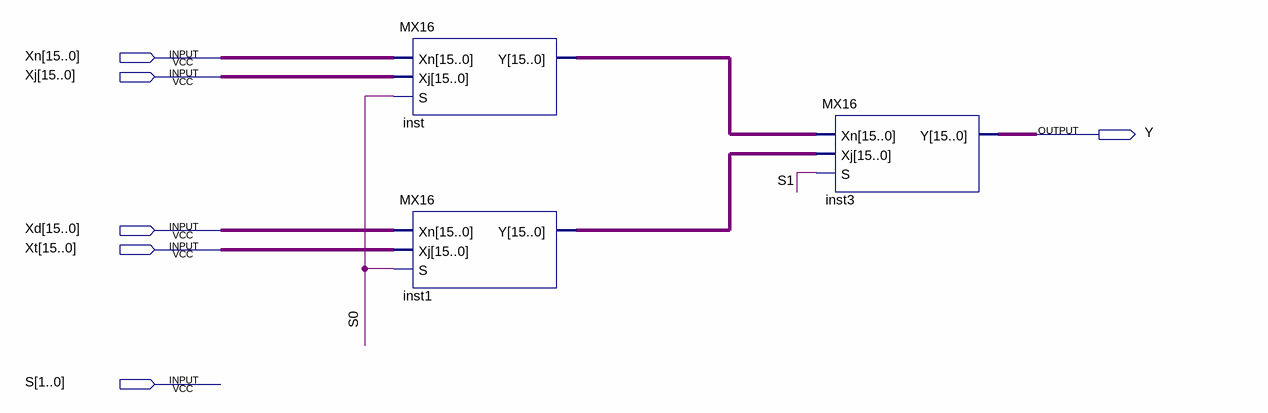
[diagram p0: schematic sheet]
// Quartus schematic MX16,4.bdf as structural Verilog: 3 symbols, 6 pins
module \MX16,4  (
  input  [15:0] Xn,
  input  [15:0] Xj,
  input  [15:0] Xd,
  input  [15:0] Xt,
  input  [1:0] S,
  output Y
);

  wire [15:0] inst1_y, inst3_y, inst_y;

  MX16 inst (.Xn(Xn), .Xj(Xj), .S(S[0]), .Y(inst_y));
  MX16 inst1 (.Xn(Xd), .Xj(Xt), .S(S[0]), .Y(inst1_y));
  MX16 inst3 (.Xn(inst_y), .Xj(inst1_y), .S(S[1]), .Y(inst3_y));
endmodule
